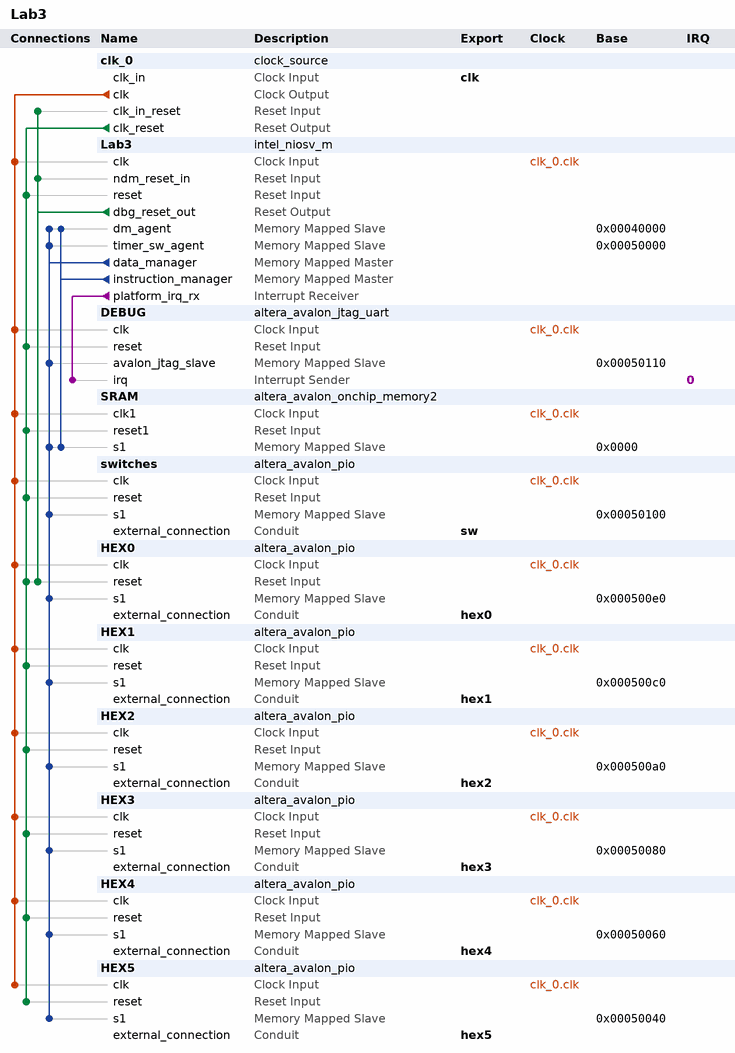
[diagram p0: system contents]
# Platform Designer (Qsys) system Lab3, Cyclone V 5CSXFC6D6F31C6
# Parameters at their usual value, and those the tool derives, are not listed.
package require -exact qsys 23.1
create_system Lab3
set_project_property DEVICE_FAMILY {Cyclone V}
set_project_property DEVICE 5CSXFC6D6F31C6

add_instance clk_0 clock_source 23.1
set_instance_parameter_value clk_0 clockFrequency 50000000

add_instance Lab3 intel_niosv_m 2.0.0
set_instance_parameter_value Lab3 enableDebugReset true
set_instance_parameter_value Lab3 enableECCLite false
set_instance_parameter_value Lab3 pipelineArch true
set_instance_parameter_value Lab3 resetSlave SRAM.s1

add_instance DEBUG altera_avalon_jtag_uart 23.1
set_instance_parameter_value DEBUG simInteractiveOptions NO_INTERACTIVE_WINDOWS

add_instance SRAM altera_avalon_onchip_memory2 23.1
set_instance_parameter_value SRAM dataWidth 32
set_instance_parameter_value SRAM dualPort false
set_instance_parameter_value SRAM initMemContent true
set_instance_parameter_value SRAM initializationFileName onchip_mem.hex
set_instance_parameter_value SRAM memorySize 204800

add_instance switches altera_avalon_pio 23.1
set_instance_parameter_value switches direction Input
set_instance_parameter_value switches width 9

add_instance HEX0 altera_avalon_pio 23.1
set_instance_parameter_value HEX0 bitModifyingOutReg true
set_instance_parameter_value HEX0 direction Output
set_instance_parameter_value HEX0 width 7

add_instance HEX1 altera_avalon_pio 23.1
set_instance_parameter_value HEX1 bitModifyingOutReg true
set_instance_parameter_value HEX1 direction Output
set_instance_parameter_value HEX1 width 7

add_instance HEX2 altera_avalon_pio 23.1
set_instance_parameter_value HEX2 bitModifyingOutReg true
set_instance_parameter_value HEX2 direction Output
set_instance_parameter_value HEX2 width 7

add_instance HEX3 altera_avalon_pio 23.1
set_instance_parameter_value HEX3 bitModifyingOutReg true
set_instance_parameter_value HEX3 direction Output
set_instance_parameter_value HEX3 width 7

add_instance HEX4 altera_avalon_pio 23.1
set_instance_parameter_value HEX4 bitModifyingOutReg true
set_instance_parameter_value HEX4 direction Output
set_instance_parameter_value HEX4 width 7

add_instance HEX5 altera_avalon_pio 23.1
set_instance_parameter_value HEX5 bitModifyingOutReg true
set_instance_parameter_value HEX5 direction Output
set_instance_parameter_value HEX5 width 7

# connections
add_connection clk_0.clk DEBUG.clk clock
add_connection clk_0.clk HEX0.clk clock
add_connection clk_0.clk HEX1.clk clock
add_connection clk_0.clk HEX2.clk clock
add_connection clk_0.clk HEX3.clk clock
add_connection clk_0.clk HEX4.clk clock
add_connection clk_0.clk HEX5.clk clock
add_connection clk_0.clk Lab3.clk clock
add_connection clk_0.clk SRAM.clk1 clock
add_connection clk_0.clk switches.clk clock
add_connection clk_0.clk_reset DEBUG.reset reset
add_connection clk_0.clk_reset HEX0.reset reset
add_connection clk_0.clk_reset HEX1.reset reset
add_connection clk_0.clk_reset HEX2.reset reset
add_connection clk_0.clk_reset HEX3.reset reset
add_connection clk_0.clk_reset HEX4.reset reset
add_connection clk_0.clk_reset HEX5.reset reset
add_connection clk_0.clk_reset Lab3.reset reset
add_connection clk_0.clk_reset SRAM.reset1 reset
add_connection clk_0.clk_reset switches.reset reset
add_connection Lab3.dbg_reset_out clk_0.clk_in_reset reset
add_connection Lab3.dbg_reset_out HEX0.reset reset
add_connection Lab3.dbg_reset_out Lab3.ndm_reset_in reset
add_connection Lab3.data_manager DEBUG.avalon_jtag_slave avalon
set_connection_parameter_value Lab3.data_manager/DEBUG.avalon_jtag_slave baseAddress 0x00050110
add_connection Lab3.data_manager HEX0.s1 avalon
set_connection_parameter_value Lab3.data_manager/HEX0.s1 baseAddress 0x000500e0
add_connection Lab3.data_manager HEX1.s1 avalon
set_connection_parameter_value Lab3.data_manager/HEX1.s1 baseAddress 0x000500c0
add_connection Lab3.data_manager HEX2.s1 avalon
set_connection_parameter_value Lab3.data_manager/HEX2.s1 baseAddress 0x000500a0
add_connection Lab3.data_manager HEX3.s1 avalon
set_connection_parameter_value Lab3.data_manager/HEX3.s1 baseAddress 0x00050080
add_connection Lab3.data_manager HEX4.s1 avalon
set_connection_parameter_value Lab3.data_manager/HEX4.s1 baseAddress 0x00050060
add_connection Lab3.data_manager HEX5.s1 avalon
set_connection_parameter_value Lab3.data_manager/HEX5.s1 baseAddress 0x00050040
add_connection Lab3.data_manager Lab3.dm_agent avalon
set_connection_parameter_value Lab3.data_manager/Lab3.dm_agent baseAddress 0x00040000
add_connection Lab3.data_manager Lab3.timer_sw_agent avalon
set_connection_parameter_value Lab3.data_manager/Lab3.timer_sw_agent baseAddress 0x00050000
add_connection Lab3.data_manager SRAM.s1 avalon
set_connection_parameter_value Lab3.data_manager/SRAM.s1 baseAddress 0x0000
add_connection Lab3.data_manager switches.s1 avalon
set_connection_parameter_value Lab3.data_manager/switches.s1 baseAddress 0x00050100
add_connection Lab3.instruction_manager Lab3.dm_agent avalon
set_connection_parameter_value Lab3.instruction_manager/Lab3.dm_agent baseAddress 0x00040000
add_connection Lab3.instruction_manager SRAM.s1 avalon
set_connection_parameter_value Lab3.instruction_manager/SRAM.s1 baseAddress 0x0000
add_connection Lab3.platform_irq_rx DEBUG.irq interrupt
set_connection_parameter_value Lab3.platform_irq_rx/DEBUG.irq irqNumber 0

# exported interfaces
add_interface clk clock sink
set_interface_property clk EXPORT_OF clk_0.clk_in
add_interface hex0 conduit end
set_interface_property hex0 EXPORT_OF HEX0.external_connection
add_interface hex1 conduit end
set_interface_property hex1 EXPORT_OF HEX1.external_connection
add_interface hex2 conduit end
set_interface_property hex2 EXPORT_OF HEX2.external_connection
add_interface hex3 conduit end
set_interface_property hex3 EXPORT_OF HEX3.external_connection
add_interface hex4 conduit end
set_interface_property hex4 EXPORT_OF HEX4.external_connection
add_interface hex5 conduit end
set_interface_property hex5 EXPORT_OF HEX5.external_connection
add_interface sw conduit end
set_interface_property sw EXPORT_OF switches.external_connection

set_interconnect_requirement {$system} qsys_mm.clockCrossingAdapter HANDSHAKE
set_interconnect_requirement {$system} qsys_mm.enableEccProtection FALSE
set_interconnect_requirement {$system} qsys_mm.insertDefaultSlave FALSE
set_interconnect_requirement {$system} qsys_mm.maxAdditionalLatency 1

save_system Lab3.qsys
